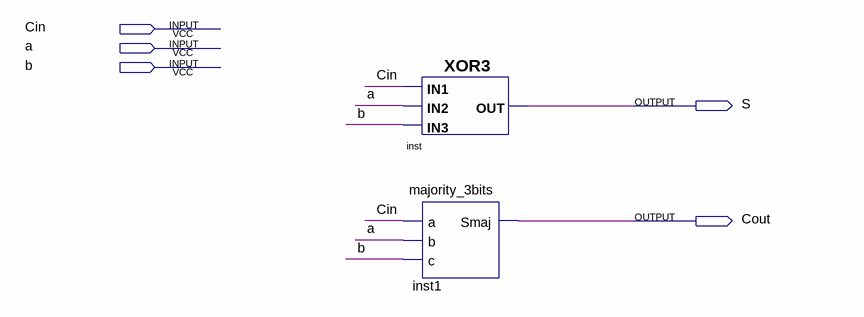
[diagram p0: schematic sheet]
// Quartus schematic full_adder.bdf as structural Verilog: 2 symbols, 5 pins
module full_adder (
  input  Cin,
  input  a,
  input  b,
  output S,
  output Cout
);

  XOR3 inst (.IN3(b), .IN1(Cin), .IN2(a), .OUT(S));
  majority_3bits inst1 (.a(Cin), .b(a), .c(b), .Smaj(Cout));
endmodule
